# EAGLE design ButtonsLEDs (EAGLE 7.4.0)
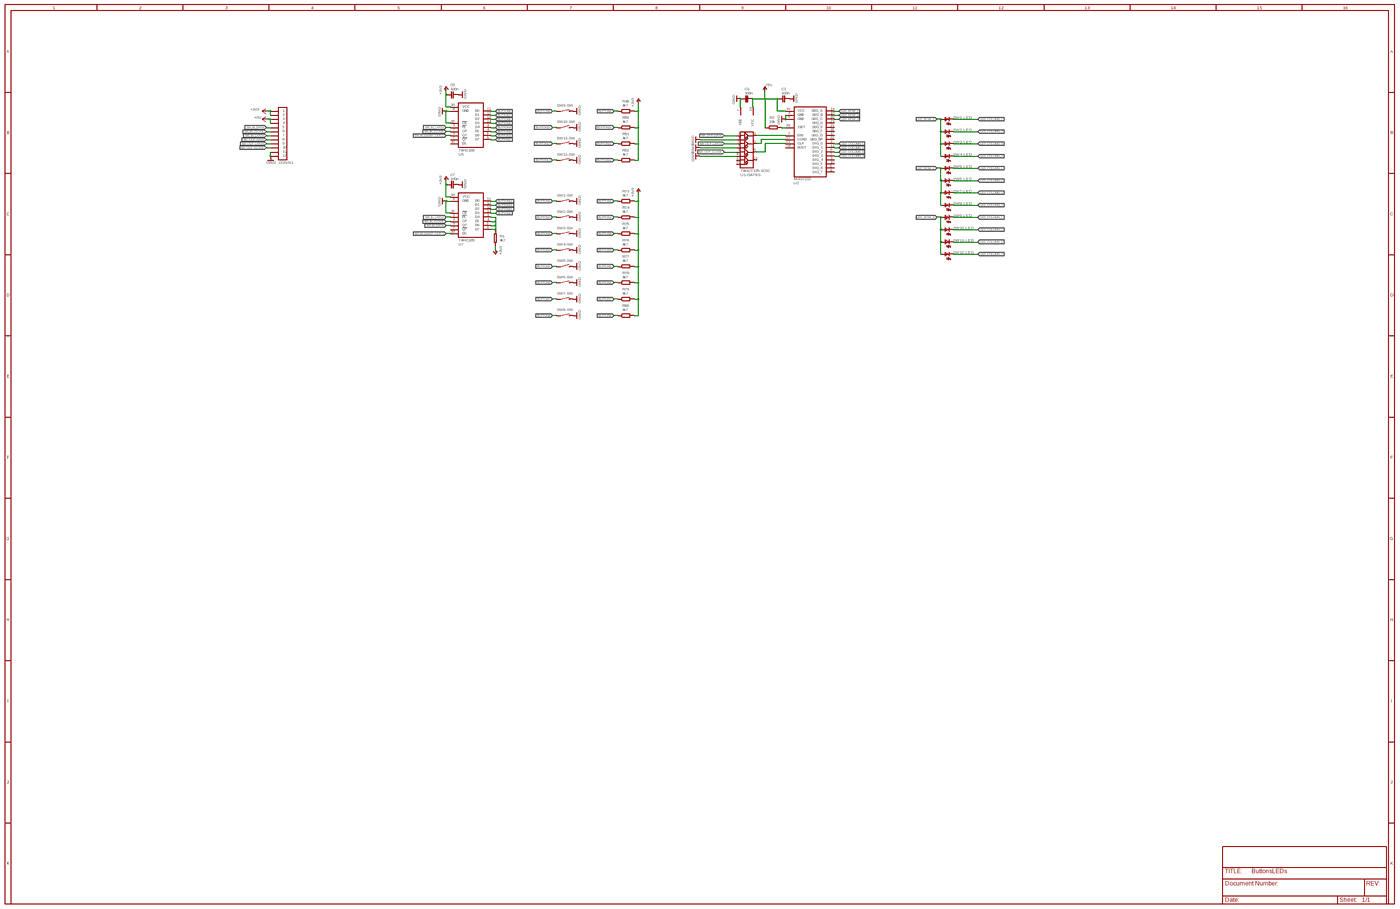
[diagram p0: schematic, sheet 1, overview]
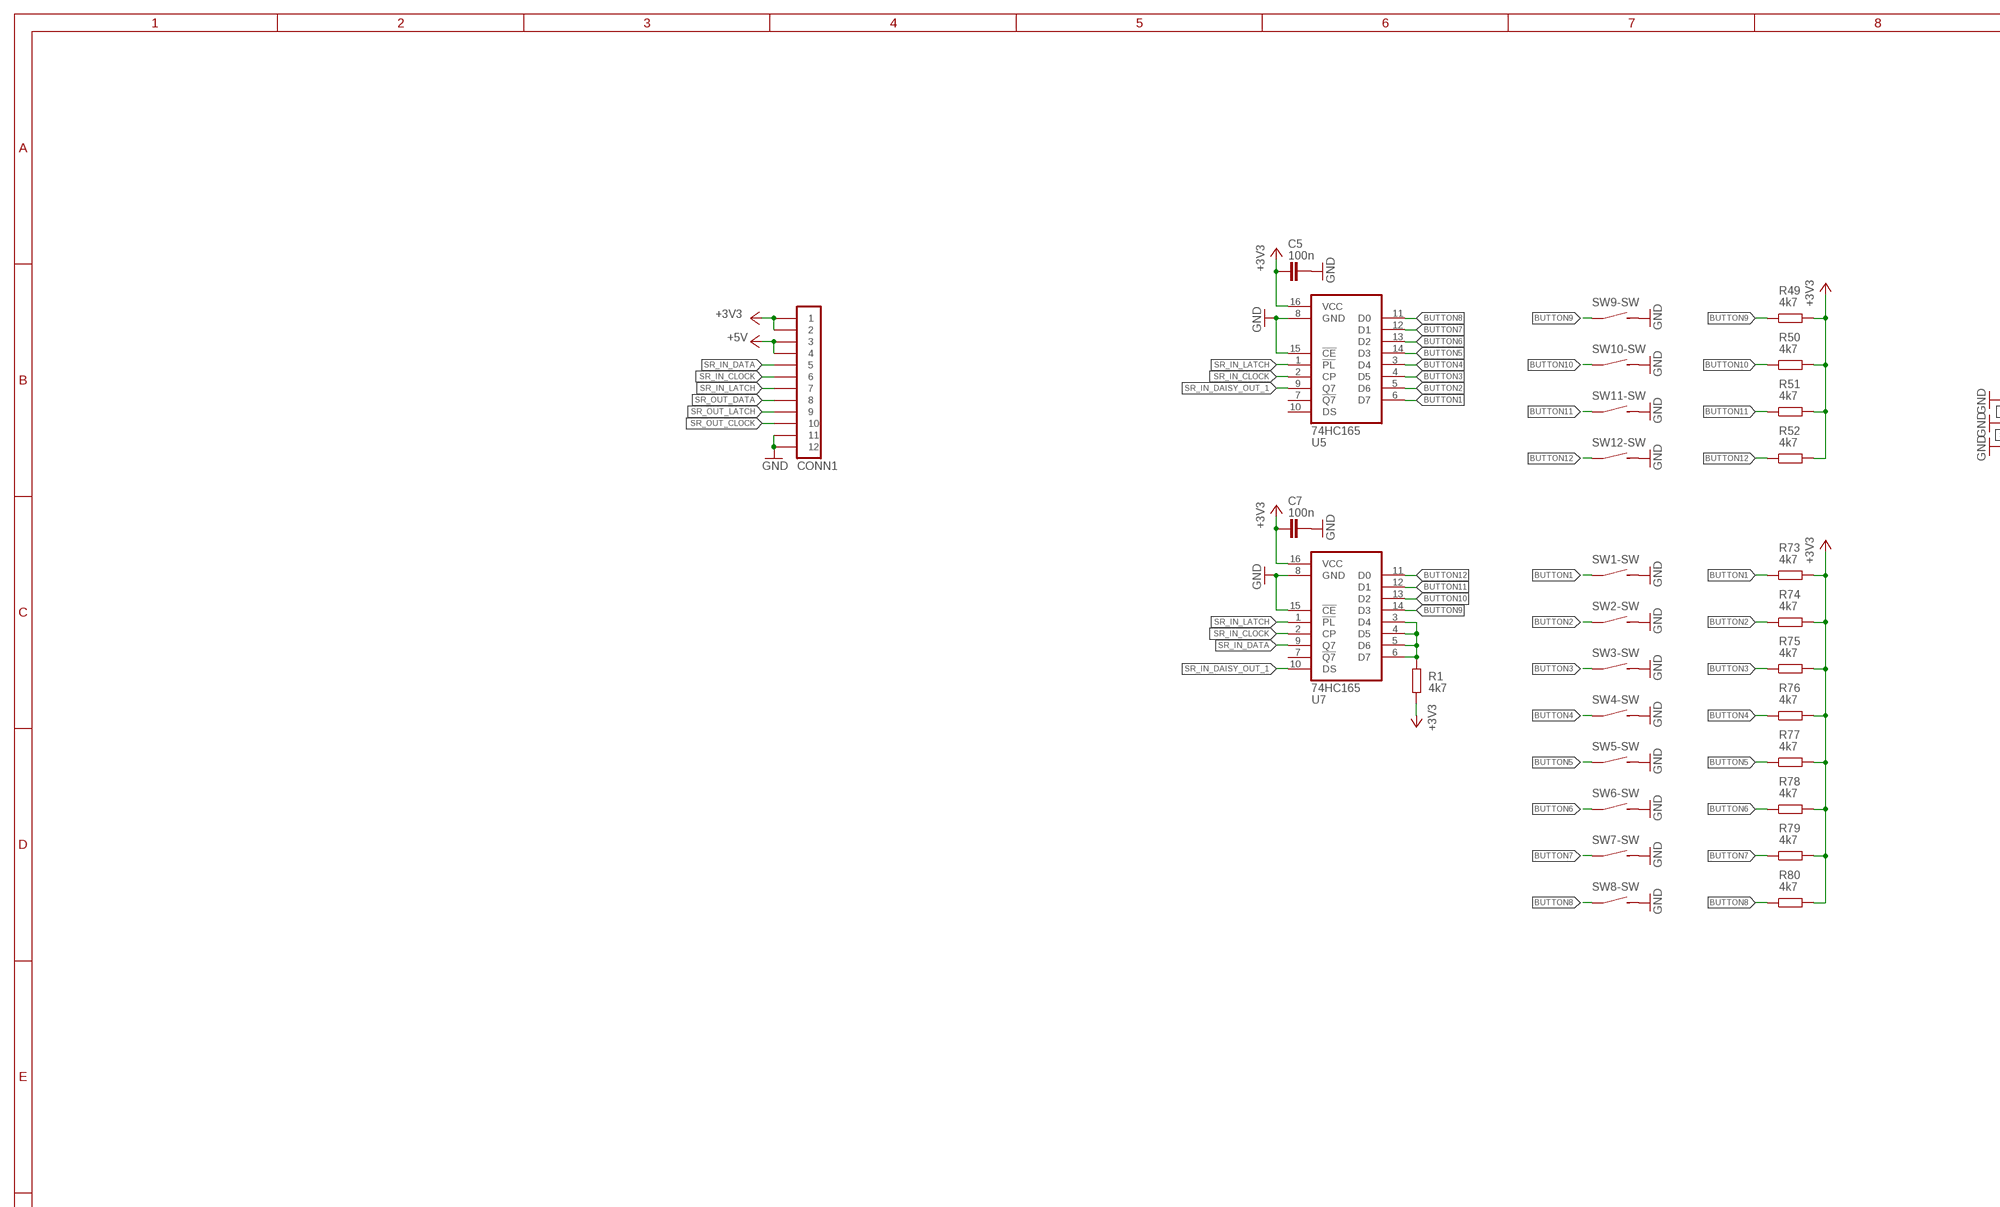
[diagram p1: schematic, sheet 1, part 1 of 4]
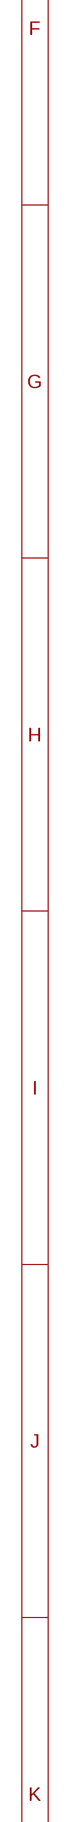
[diagram p2: schematic, sheet 1, part 2 of 4]
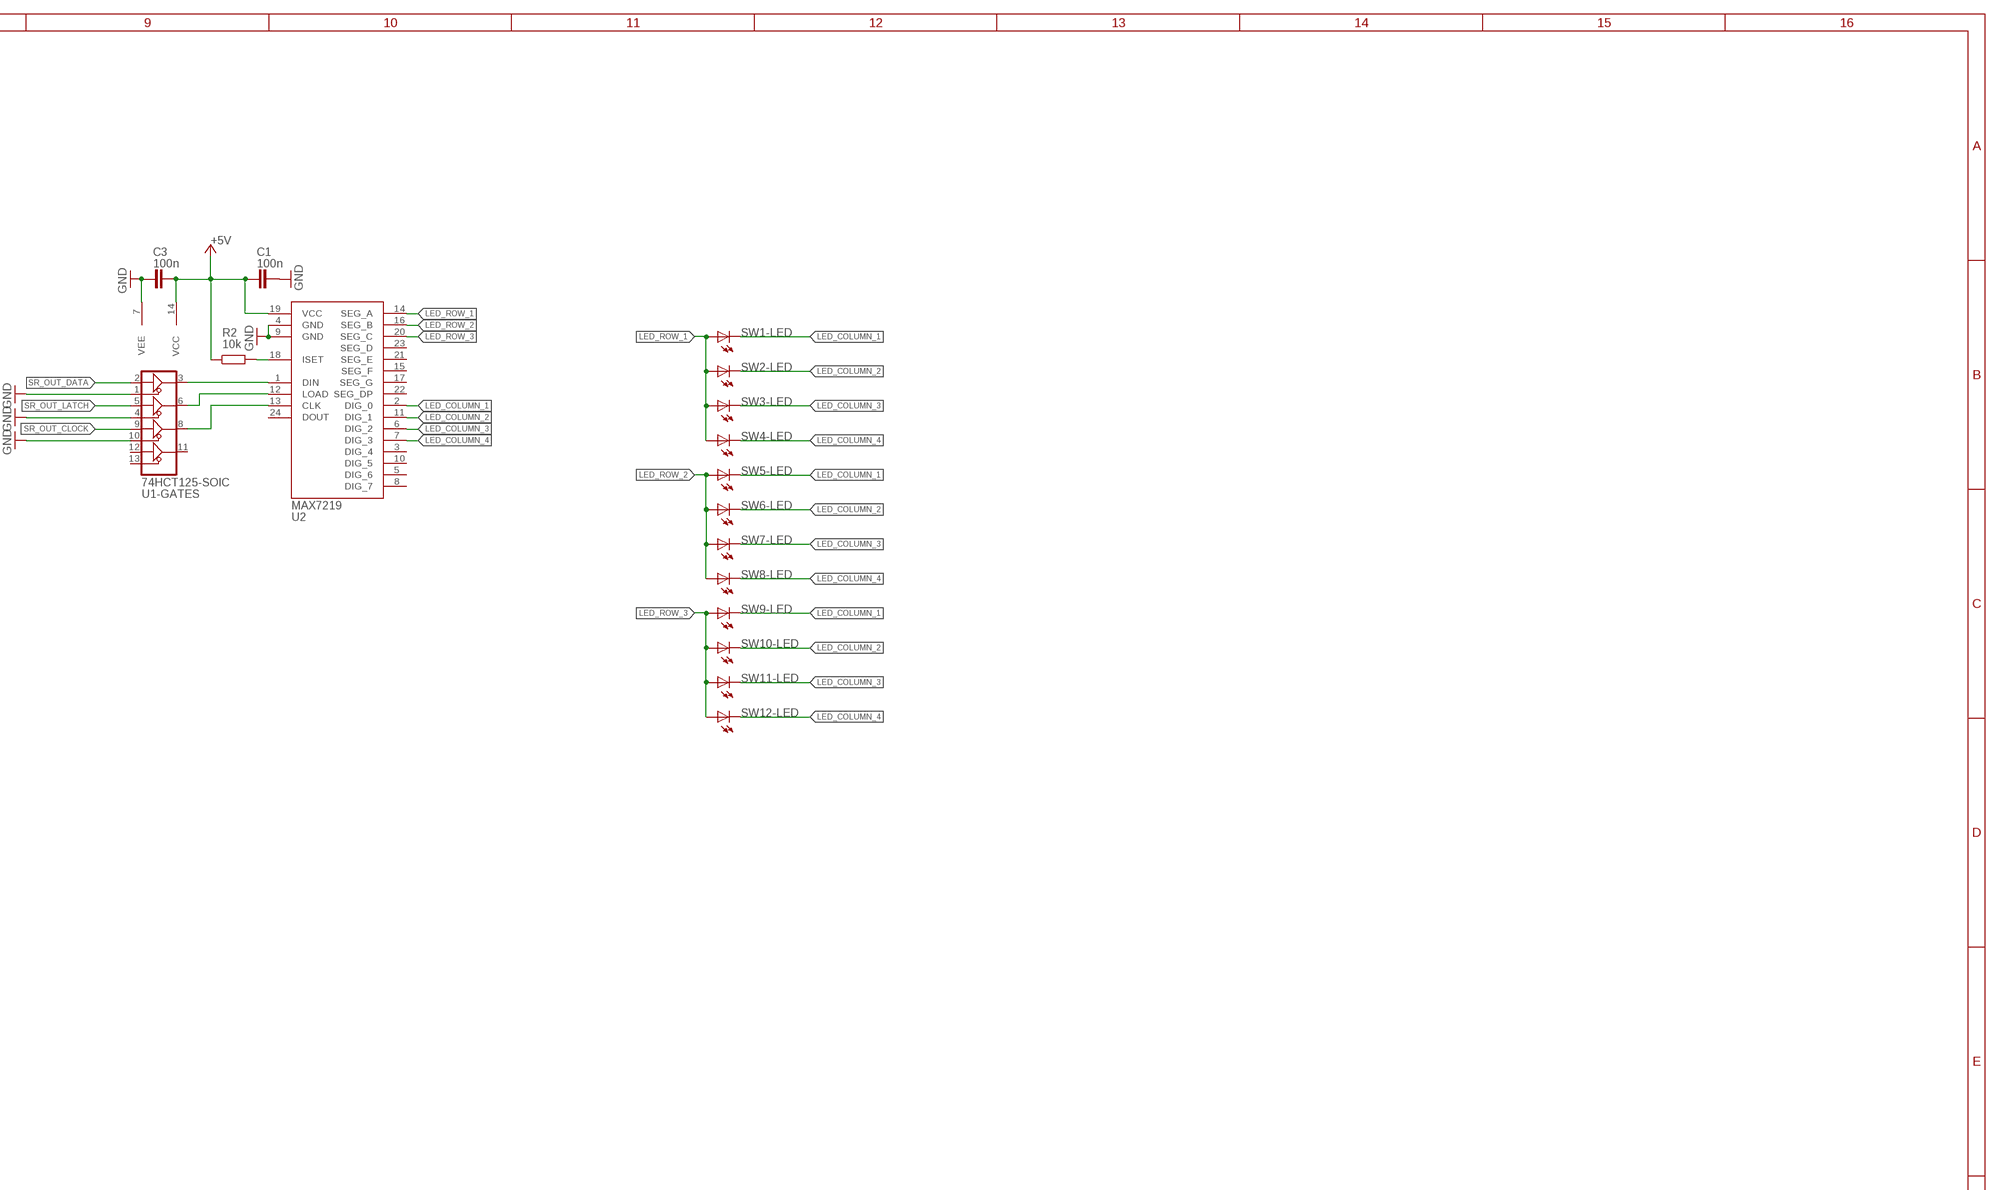
[diagram p3: schematic, sheet 1, part 3 of 4]
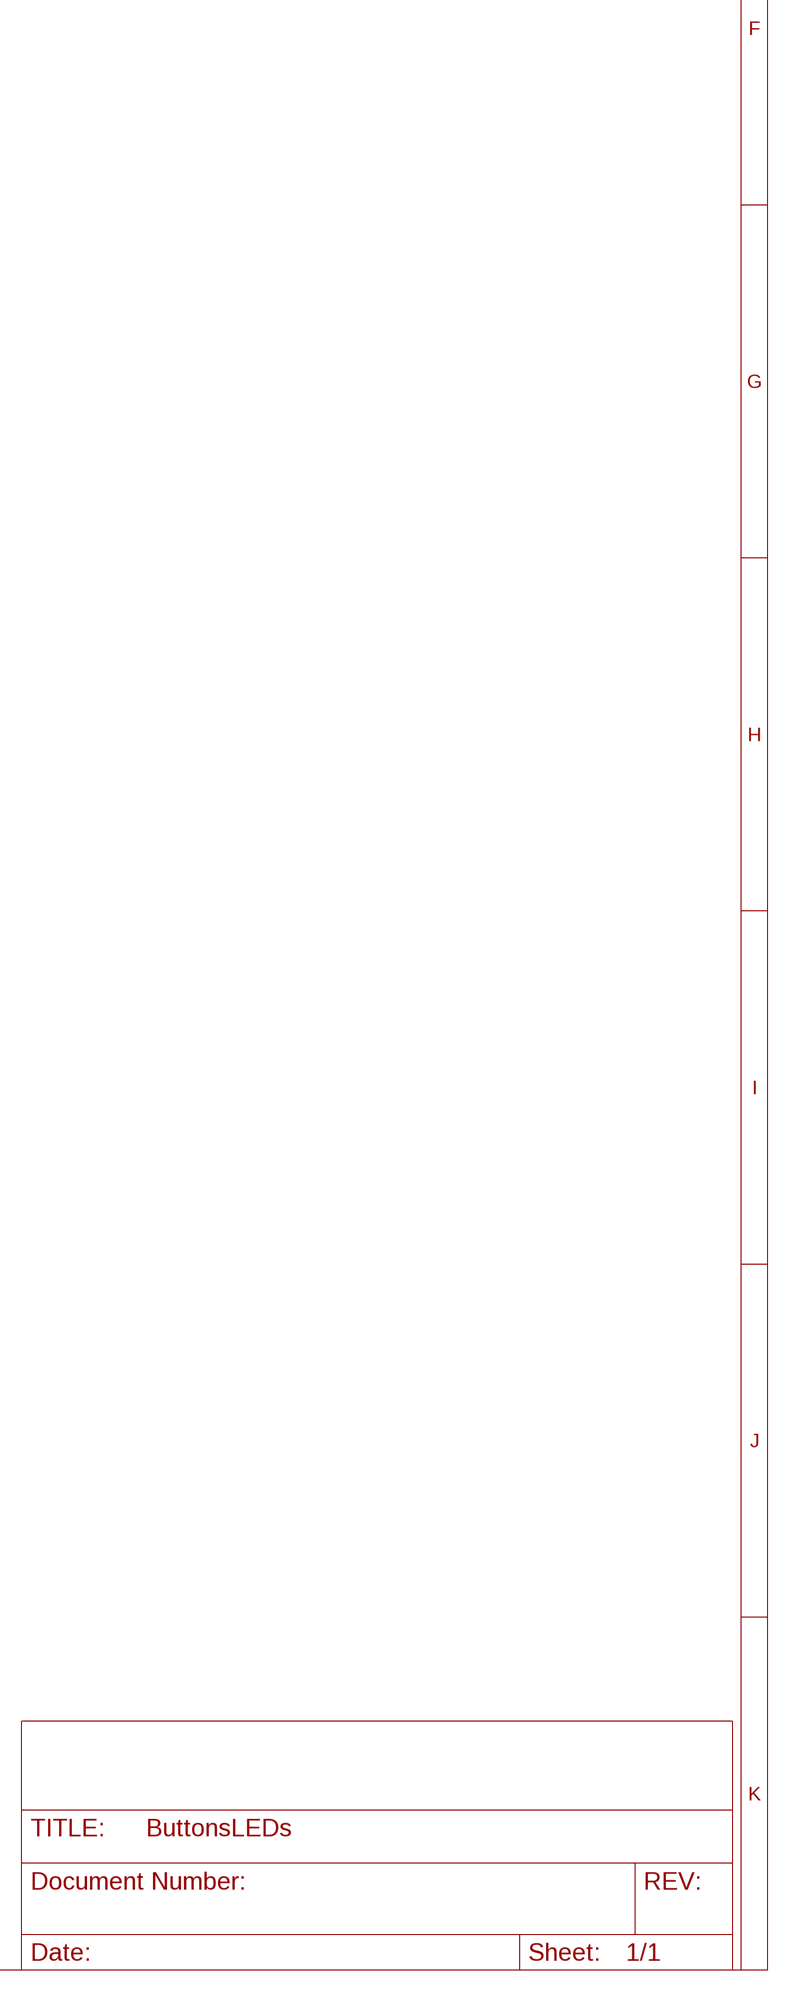
[diagram p4: schematic, sheet 1, part 4 of 4]

## Parts
C1  100n  CAPACITOR-0805  [C0805]
C3  100n  CAPACITOR-0805  [C0805]
C5  100n  CAPACITOR-0805  [C0805]
C7  100n  CAPACITOR-0805  [C0805]
CONN1  PINHD-1X12-SMD  [MOLEX-52271-1279]
R1  4k7  RESISTOR-0805  [R0805]
R2  10k  RESISTOR-0805  [R0805]
R49  4k7  RESISTOR-0805  [R0805]
R50  4k7  RESISTOR-0805  [R0805]
R51  4k7  RESISTOR-0805  [R0805]
R52  4k7  RESISTOR-0805  [R0805]
R73  4k7  RESISTOR-0805  [R0805]
R74  4k7  RESISTOR-0805  [R0805]
R75  4k7  RESISTOR-0805  [R0805]
R76  4k7  RESISTOR-0805  [R0805]
R77  4k7  RESISTOR-0805  [R0805]
R78  4k7  RESISTOR-0805  [R0805]
R79  4k7  RESISTOR-0805  [R0805]
R80  4k7  RESISTOR-0805  [R0805]
SW1  OMRON-B3W-9  [OMRON-B3W-9]
SW2  OMRON-B3W-9  [OMRON-B3W-9]
SW3  OMRON-B3W-9  [OMRON-B3W-9]
SW4  OMRON-B3W-9  [OMRON-B3W-9]
SW5  OMRON-B3W-9  [OMRON-B3W-9]
SW6  OMRON-B3W-9  [OMRON-B3W-9]
SW7  OMRON-B3W-9  [OMRON-B3W-9]
SW8  OMRON-B3W-9  [OMRON-B3W-9]
SW9  OMRON-B3W-9  [OMRON-B3W-9]
SW10  OMRON-B3W-9  [OMRON-B3W-9]
SW11  OMRON-B3W-9  [OMRON-B3W-9]
SW12  OMRON-B3W-9  [OMRON-B3W-9]
U1  74HCT125-SOIC  [SOIC14]
U2  MAX7219  [SO24-W]
U5  74HC165  [SO16]
U7  74HC165  [SO16]

## Nets
+3V3: C5.1 C7.1 CONN1.1 CONN1.2 R1.2 R49.2 R50.2 R51.2 R52.2 R73.2 R74.2 R75.2 R76.2 R77.2 R78.2 R79.2 R80.2 U5.16(VCC) U7.16(VCC)
+5V: C1.1 C3.1 CONN1.3 CONN1.4 R2.1 U1.14(-VCC:VCC) U2.19(VCC)
BUTTON1: R73.1 SW1.1 U5.6(D7)
BUTTON2: R74.1 SW2.1 U5.5(D6)
BUTTON3: R75.1 SW3.1 U5.4(D5)
BUTTON4: R76.1 SW4.1 U5.3(D4)
BUTTON5: R77.1 SW5.1 U5.14(D3)
BUTTON6: R78.1 SW6.1 U5.13(D2)
BUTTON7: R79.1 SW7.1 U5.12(D1)
BUTTON8: R80.1 SW8.1 U5.11(D0)
BUTTON9: R49.1 SW9.1 U7.14(D3)
BUTTON10: R50.1 SW10.1 U7.13(D2)
BUTTON11: R51.1 SW11.1 U7.12(D1)
BUTTON12: R52.1 SW12.1 U7.11(D0)
GND: C1.2 C3.2 C5.2 C7.2 CONN1.11 CONN1.12 SW1.3 SW2.3 SW3.3 SW4.3 SW5.3 SW6.3 SW7.3 SW8.3 SW9.3 SW10.3 SW11.3 SW12.3 U1.1(-GATES:1!(OE)) U1.4(-GATES:2!(OE)) U1.7(-GND:VEE) U1.10(-GATES:3!(OE)) U2.4(GND) U2.9(GND) U5.8(GND) U5.15(!CE) U7.8(GND) U7.15(!CE)
LED_COLUMN_1: SW1.6-C(-LED:C) SW5.6-C(-LED:C) SW9.6-C(-LED:C) U2.2(DIG_0)
LED_COLUMN_2: SW2.6-C(-LED:C) SW6.6-C(-LED:C) SW10.6-C(-LED:C) U2.11(DIG_1)
LED_COLUMN_3: SW3.6-C(-LED:C) SW7.6-C(-LED:C) SW11.6-C(-LED:C) U2.6(DIG_2)
LED_COLUMN_4: SW4.6-C(-LED:C) SW8.6-C(-LED:C) SW12.6-C(-LED:C) U2.7(DIG_3)
LED_ROW_1: SW1.6-A(-LED:A) SW2.6-A(-LED:A) SW3.6-A(-LED:A) SW4.6-A(-LED:A) U2.14(SEG_A)
LED_ROW_2: SW5.6-A(-LED:A) SW6.6-A(-LED:A) SW7.6-A(-LED:A) SW8.6-A(-LED:A) U2.16(SEG_B)
LED_ROW_3: SW9.6-A(-LED:A) SW10.6-A(-LED:A) SW11.6-A(-LED:A) SW12.6-A(-LED:A) U2.20(SEG_C)
N$1: R1.1 U7.3(D4) U7.4(D5) U7.5(D6) U7.6(D7)
N$2: U1.3(-GATES:1Y) U2.1(DIN)
N$3: U1.6(-GATES:2Y) U2.12(LOAD)
N$4: U1.8(-GATES:3Y) U2.13(CLK)
N$5: R2.2 U2.18(ISET)
SR_IN_CLOCK: CONN1.6 U5.2(CP) U7.2(CP)
SR_IN_DAISY_OUT_1: U5.9(Q7) U7.10(DS)
SR_IN_DATA: CONN1.5 U7.9(Q7)
SR_IN_LATCH: CONN1.7 U5.1(!PL) U7.1(!PL)
SR_OUT_CLOCK: CONN1.10 U1.9(-GATES:3A)
SR_OUT_DATA: CONN1.8 U1.2(-GATES:1A)
SR_OUT_LATCH: CONN1.9 U1.5(-GATES:2A)
Unconnected: U1.11(-GATES:4Y) U1.12(-GATES:4A) U1.13(-GATES:4!(OE)) U2.3(DIG_4) U2.5(DIG_6) U2.8(DIG_7) U2.10(DIG_5) U2.15(SEG_F) U2.17(SEG_G) U2.21(SEG_E) U2.22(SEG_DP) U2.23(SEG_D) U2.24(DOUT) U5.7(!Q7) U5.10(DS) U7.7(!Q7)

## Library data of the parts
C1 C3 C5 C7 = igor_lbr:CAPACITOR: Capacitor
CONN1 = igor_lbr:PINHD-1X12: Pin header; MANUFACTURER: Molex; MPN: 52271-1279
R1 R2 R49-R52 R73-R80 = igor_lbr:RESISTOR: Resistor
SW1-SW12 = igor_lbr:OMRON-B3W-9: Illuminated Tactile Switch; MANUFACTURER: Omron; MPN: B3W-9002
U1 = igor_lbr:74*125: Quad buffer/line driver; MANUFACTURER: Nexperia; MPN: 74HCT125D
U2 = igor_lbr:MAX7219: Serially Interfaced, 8-Digit LED Display Drivers
U5 U7 = igor_lbr:74*165: 8-bit parallel-in/serial out shift register; MANUFACTURER: Nexperia; MPN: 74HC165D

## Board
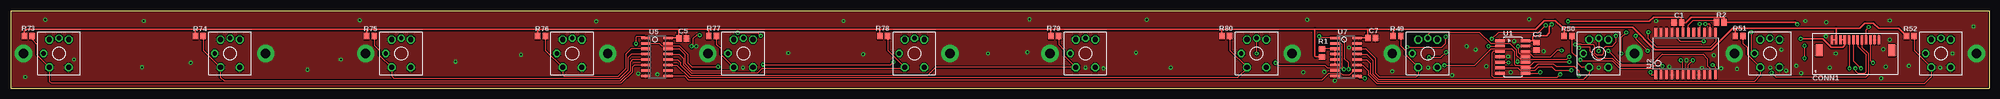
[diagram p5: board, top side]
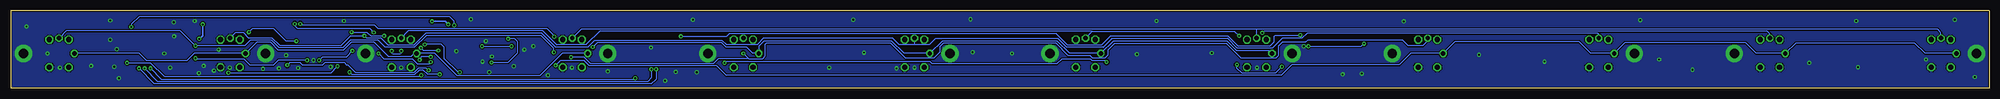
[diagram p6: board, bottom side, seen from below]

Size 462.6 x 18.1 mm. Coordinates in mm from the lower left corner, seen from the top.
Outline: 0,18.1 0,0 462.6,0 462.6,18.1 0,18.1
Copper layers (1*16): Top 0.035mm / dielectric 1.5mm / Bottom 0.035mm
Design rules "smiery": minimum track width 10mil, minimum drill 12mil, track to track 7mil, track to pad 5mil, pad to pad 5mil, via to via 6mil, smd to smd 0mil, copper to edge 12mil, drill to drill 10mil, minimum pad ring 13mil, minimum via ring 10mil, stop-mask expansion 2mil, vias tented up to drill 25mil, thermal gap 10mil

### Footprints (pad centres in the part's own frame; a part is rotated, then mirrored left to right if it is on the bottom)
C0805 = smd 1.27 x 1.524: 1 -0.9,0; 2 0.9,0
MOLEX-52271-1279 = smd 0.6 x 2.2: 1 -5.5,3.5; 2 -4.5,3.5; 3 -3.5,3.5; 4 -2.5,3.5; 5 -1.5,3.5; 6 -0.5,3.5; 7 0.5,3.5; 8 1.5,3.5; 9 2.5,3.5; 10 3.5,3.5; 11 4.5,3.5; 12 5.5,3.5 | smd 1.65 x 2.8: S1 -8.5,1; S2 8.5,1
R0805 = smd 1.27 x 1.524: 1 -0.9,0; 2 0.9,0
OMRON-B3W-9 = drill 1.2 octagon: 1 -3.25,2.25; 2 3.25,2.25; 3 -3.25,-2.25; 4 3.25,-2.25 | drill 1 octagon: 6-A 0,3.6; 6-C 3.6,0
SOIC14 = smd 2.2 x 0.66: 1 -3,3.81; 2 -3,2.54; 3 -3,1.27; 4 -3,0; 5 -3,-1.27; 6 -3,-2.54; 7 -3,-3.81; 8 3,-3.81; 9 3,-2.54; 10 3,-1.27; 11 3,0; 12 3,1.27; 13 3,2.54; 14 3,3.81
SO24-W = smd 2.032 x 0.6: 1 -4.975,6.985; 2 -4.975,5.715; 3 -4.975,4.445; 4 -4.975,3.175; 5 -4.975,1.905; 6 -4.975,0.635; 7 -4.975,-0.635; 8 -4.975,-1.905; 9 -4.975,-3.175; 10 -4.975,-4.445; 11 -4.975,-5.715; 12 -4.975,-6.985; 13 4.975,-6.985; 14 4.975,-5.715; 15 4.975,-4.445; 16 4.975,-3.175; 17 4.975,-1.905; 18 4.975,-0.635; 19 4.975,0.635; 20 4.975,1.905; 21 4.975,3.175; 22 4.975,4.445; 23 4.975,5.715; 24 4.975,6.985
SO16 = smd 2.2 x 0.6: 1 -2.6,4.445; 2 -2.6,3.175; 3 -2.6,1.905; 4 -2.6,0.635; 5 -2.6,-0.635; 6 -2.6,-1.905; 7 -2.6,-3.175; 8 -2.6,-4.445; 9 2.6,-4.445; 10 2.6,-3.175; 11 2.6,-1.905; 12 2.6,-0.635; 13 2.6,0.635; 14 2.6,1.905; 15 2.6,3.175; 16 2.6,4.445

### Placement (x,y rotation side)
C1  389.8,15.3 180 top
C3  356.7,9.8 270 top
C5  157.1,11.6 0 top
C7  318.2,11.7 0 top
CONN1  431.3,7.8 0 top
R1  306.6,8.2 270 top
R2  399.7,15.4 180 top
R49  324.1,12.2 180 top
R50  364.1,12.2 180 top
R51  404.1,12.2 180 top
R52  444.1,12.2 180 top
R73  4.1,12.2 180 top
R74  44.1,12.2 180 top
R75  84.1,12.2 180 top
R76  124.1,12.2 180 top
R77  164.1,12.2 180 top
R78  204.1,12.2 180 top
R79  244.1,12.2 180 top
R80  284.1,12.2 180 top
SW1  11.3,8.1 90 top
SW2  51.3,8.1 90 top
SW3  91.3,8.1 90 top
SW4  131.3,8.1 90 top
SW5  171.3,8.1 90 top
SW6  211.3,8.1 90 top
SW7  251.3,8.1 90 top
SW8  291.3,8.1 90 top
SW9  331.3,8.1 90 top
SW10  371.3,8.1 90 top
SW11  411.3,8.1 90 top
SW12  451.3,8.1 90 top
U1  351.2,7.3 0 top
U2  391.6,8.1 90 top
U5  151.1,7.3 0 top
U7  312.2,7.3 0 top

### Tracks (layer width: path | path; a pad name or v marks a point on that pad's centre or on a via)
+3V3
  Top 0.406: R73.2 3.2,13.3 3.7,13.8 43.2,13.8 | 43.2,13.8 83.3,13.8 | 83.3,13.8 123.4,13.8 | 123.4,13.8 156.2,13.8 | 156.2,13.8 163.2,13.8 | 163.2,13.8 203.3,13.8 | 203.3,13.8 243.1,13.8 | 243.1,13.8 283.3,13.8 | 283.3,13.8 304.9,13.8 | 304.9,13.8 317.2,13.8 | 317.2,13.8 323.3,13.8 | 323.3,13.8 356.6,13.8 358.6,15.8 361.1,15.8 362.7,14.2 | 362.7,14.2 363.2,13.7 R50.2 | 403.2,14 402.6,14 397.6,9 384.4,9 379.2,14.2 362.7,14.2 | 403.2,14 426.8,14 | 426.8,14 432.3,14 433.5,15.2 435.5,15.2 436.7,14 441.4,14 R52.2 | R51.2 403.2,14 | R49.2 323.2,13.7 323.3,13.8 | U7.16 317.25,11.74 C7.1 317.3,13.7 317.2,13.8 | R80.2 283.2,13.7 283.3,13.8 | R79.2 243.2,13.7 243.1,13.8 | R78.2 203.2,13.7 203.3,13.8 | R77.2 163.2,13.8 | U5.16 156.06,11.74 C5.1 156.2,13.8 | R76.2 123.2,13.6 123.4,13.8 | R75.2 83.2,13.7 83.3,13.8 | R74.2 43.2,13.8 | R1.2 305.1,7.3 304.9,7.5 304.9,13.8 | CONN1.1 CONN1.2 426.8,14
+5V  (via drill 0.4 pad 0.6)
  Top 0.406: U1.14 355.9,11.11 | 355.9,11.11 356.29,11.11 C3.1 | C1.1 391.6,15.3 392.9,16.6 400.4,16.6 400.6,16.4 R2.1 417.2,15.4 v417.7,14.9 | U2.19 390.96,15.04 C1.1 | v360.3,14.9 359.7,14.3 359.7,12.9 359.1,12.3 356.2,12.3 355.9,12 355.9,11.11 | C1.1 390.6,15.4 390.6,16.4 390.4,16.6 384.1,16.6 383.1,15.6 v364.1,15.6 | CONN1.3 CONN1.4 428.8,10 428.3,9.5 425.7,9.5 423.7,11.5 v418.5,11.5
  Bottom 0.406: v364.1,15.6 361,15.6 v360.3,14.9 | v417.7,14.9 417.7,12.3 v418.5,11.5
BUTTON1
  Top 0.254: U5.6 145.79,5.39 145.3,4.9 145.3,3.7 142.8,1.2 9.5,1.2 9.05,1.65 SW1.1 6.1,7.8 6.1,10.3 5,11.4 R73.1
BUTTON2
  Top 0.254: U5.5 145.37,6.67 144.8,6.1 144.8,4 142.5,1.7 49.9,1.7 49.05,2.55 SW2.1 45,8.9 R74.1
BUTTON3
  Top 0.254: U5.4 145.13,7.93 144.3,7.1 144.3,4.2 142.4,2.3 89.6,2.3 89.05,2.85 SW3.1 86.2,7.7 86.2,8.8 85,10 R75.1
BUTTON4
  Top 0.254: U5.3 145.1,9.21 143.8,7.9 143.8,4.5 142.1,2.8 129.4,2.8 129.05,3.15 SW4.1 125,8.9 R76.1
BUTTON5
  Top 0.254: U5.14 156.29,9.21 157.7,7.8 157.7,5.7 159.4,4 168.9,4 169.05,4.15 SW5.1 166,7.9 166,9.3 165,10.3 R77.1
BUTTON6
  Top 0.254: U5.13 156.26,7.93 157.2,7 157.2,5.5 159.2,3.5 174.6,3.5 175.75,4.65 208.85,4.65 SW6.1 205,8.9 R78.1
BUTTON7
  Top 0.254: U5.12 155.94,6.67 156.7,5.9 156.7,5.3 159,3 214.4,3 216.25,4.85 SW7.1 246.3,7.6 246.3,8.9 245,10.2 R79.1
BUTTON8
  Top 0.254: U5.11 155.71,5.39 158.6,2.5 286.9,2.5 289.05,4.65 SW8.1 285,8.9 R80.1
BUTTON9
  Top 0.254: U7.14 316.8,9.21 319.1,6.9 319.1,3.5 320.1,2.5 328.5,2.5 329.05,3.05 SW9.1 326,7.9 326,8.9 325,9.9 R49.1
BUTTON10
  Top 0.254: U7.13 317.06,7.93 318.5,6.5 318.5,3.4 319.9,2 367.7,2 369.05,3.35 SW10.1 367.35,4.85 366.1,6.1 366.1,7.3 365,8.4 R50.1
BUTTON11
  Top 0.254: U7.12 317.04,6.67 317.9,5.8 317.9,3.3 319.7,1.5 407.6,1.5 409.05,2.95 SW11.1 406,7.9 406,9.5 405,10.5 R51.1
BUTTON12
  Top 0.254: U7.11 316.11,5.39 317.4,4.1 317.4,3.1 319.5,1 447.4,1 449.05,2.65 SW12.1 445,8.9 R52.1
GND  (via drill 0.4 pad 0.6, 2.2 pad 4)
  other vias: 59.6,8.1 83,8.1 139.6,8.1 163,8.1 219.6,8.1 243,8.1 299.6,8.1 323,8.1 379.6,8.1 403,8.1 459.6,8.1 3,8.1 350.1,7.4 345,5.1 350.7,3.7 151.2,3.2 146.7,3.4 171.2,4.8 160.3,9.8 251.3,4.8 255.5,4.6 309.6,1.7 312.9,9.5 307.1,3.8 395.4,4.7 387.8,5 399.9,4.6 398.2,7.7 358.4,8.6 352.3,6.2 351.5,11 340.4,9.8 419.6,15.7 418.6,3.5 411.4,4.8 331.4,4.8 323,3.9 337,3 371.3,4.8 391.8,6.5 425.3,4.8 426.7,8.1 438.4,5 439.3,11.3 424.4,12.1 355,16.1 303.1,16 342.5,9 403.6,4.5 415.1,4.1 424.5,15.4 437.8,9.1 443.8,5.2 454,8.1 437.3,2.3 271.2,4.8 237.7,8.4 238.2,16.1 265.6,16 417.5,5.2 414,9 384.7,15.7 263.1,8.3 181.8,8.2 199.3,7.9 194.7,15.7 136.9,15.6 119.3,7.8 77.2,6.7 81.6,15.9 104,6.2 228.5,8.1 302.2,3.7 451.1,4.8 458.9,14.4 439.3,15.8 14.8,6.7 3.4,2.6 30.7,4.9 42.1,5.9 69.4,4.3 31.1,15.7 8.1,16
  pour Top (isolate 0.254): 0,18.1 462.6,18.1 462.6,0 0,0
  pour Bottom (isolate 0.254): 0,18.1 462.6,18.1 462.6,0 0,0
LED_COLUMN_1  (via drill 0.4 pad 0.6)
  Top 0.254: SW9.6-C 331.3,12.5 331.9,13.1 343.4,13.1 346,10.5 350.5,10.5 352,9 352,7.7 353,6.7 363.8,6.7 v364.4,7.3 | v367,6.6 367.2,6.4 374.4,6.4 376.2,4.6 385.5,4.6 385.88,4.21 U2.2
  Bottom 0.254: SW1.6-C 11.3,13 12.1,13.8 171.5,13.8 | 171.5,13.8 329.2,13.8 SW9.6-C | SW5.6-C 171.3,13.6 171.5,13.8 | v364.4,7.3 366.6,7.3 366.9,7 366.9,6.7 v367,6.6
LED_COLUMN_2  (via drill 0.4 pad 0.6)
  Top 0.254: v170,12.9 174.7,12.9 v175.4,12.2 | SW10.6-C v371.3,8.7 | v373.5,8.7 376.6,5.6 383.8,5.6 386.1,7.9 395.7,7.9 396.8,6.8 396.8,5.1 397.31,4.58 U2.11
  Bottom 0.254: SW2.6-C 51.3,12.7 51.9,13.3 169.6,13.3 v170,12.9 | SW6.6-C 209.7,13.3 | 209.7,13.3 324.9,13.3 328.1,10.1 334.9,10.1 338.2,13.4 369.6,13.4 SW10.6-C | 209.7,13.3 176.5,13.3 v175.4,12.2 | v371.3,8.7 371.3,8.2 371.6,7.9 373.2,7.9 373.5,8.2 v373.5,8.7
LED_COLUMN_3  (via drill 0.4 pad 0.6)
  Top 0.254: v379.9,12.2 379.9,11.5 v382.7,8.7 | U2.6 390.96,6.04 v390.5,6.5
  Bottom 0.254: SW3.6-C 91.3,12.6 91.5,12.8 159.5,12.8 160.7,11.6 165.3,11.6 167.6,9.3 175.8,9.3 178.1,11.6 205.1,11.6 207.2,9.5 215.7,9.5 217.7,11.5 246.4,11.5 247.8,10.1 251.4,10.1 | SW11.6-C 410.1,12.9 408.1,12.9 406.9,11.7 401.4,11.7 399.6,9.9 385.4,9.9 383.1,12.2 v379.9,12.2 379.4,11.7 376,11.7 374.3,10 368.4,10 365.6,12.8 338.4,12.8 335.2,9.6 327.7,9.6 326.2,11.1 296.2,11.1 295.2,10.1 288.1,10.1 286.6,11.6 256.4,11.6 254.9,10.1 251.4,10.1 | SW7.6-C 251.3,10.2 251.4,10.1 | v382.7,8.7 384.2,7.2 389.8,7.2 v390.5,6.5
LED_COLUMN_4  (via drill 0.4 pad 0.6)
  Top 0.254: v291.3,8.1 SW8.6-C | v331.6,7.2 334.4,7.2 v335.6,8.4 | U2.7 392.24,5.43 v393.3,6.5 | v419.4,7 v419.4,9.9
  Bottom 0.254: SW4.6-C 131.3,11.1 132.5,9.9 135.8,9.9 137.1,11.2 159.4,11.2 159.9,10.7 165.3,10.7 166.2,9.8 166.2,7.6 166.8,7 174.9,7 178.3,10.4 204.6,10.4 206.1,8.9 206.1,7.7 206.8,7 209.6,7 210.2,7.6 215.3,7.6 218.2,10.5 244.6,10.5 245.4,9.7 245.4,8.4 246.8,7 253.3,7 256.8,10.5 285.9,10.5 286.3,10.1 286.3,7.4 286.8,6.9 290.1,6.9 | 290.1,6.9 v291.3,8.1 | 290.1,6.9 297.2,6.9 298.4,5.7 327,5.7 328.5,7.2 v331.6,7.2 | SW12.6-C 449.6,13.4 422.9,13.4 v419.4,9.9 407.9,9.9 406.6,11.2 401.6,11.2 399.8,9.4 385,9.4 383.2,11.2 376.7,11.2 375,9.5 368.2,9.5 365.4,12.3 338.6,12.3 335.6,9.3 v335.6,8.4 | v393.3,6.5 400.1,6.5 401.2,5.4 406.6,5.4 408,6.8 419.2,6.8 v419.4,7
LED_ROW_1  (via drill 0.4 pad 0.6)
  Top 0.254: U2.14 397.31,14.79 397.1,15 v396.2,15 | v335.2,5.3 342.3,5.3 346.2,9.2 350.9,9.2 351.5,8.6 351.5,5.7 351.8,5.4 355.4,5.4 356.2,6.2 364.3,6.2 v364.4,6.1 | v376.6,8.1 376.6,11.9 v377.7,13
  Bottom 0.254: SW1.6-A 15,8.1 17.4,10.5 45.3,10.5 SW2.6-A 54.5,8.1 57,10.6 85.2,10.6 SW3.6-A 93.2,8.1 95.9,10.8 125,10.8 SW4.6-A 135.3,8.1 137.9,5.5 163.1,5.5 165.6,3 295.3,3 297.5,5.2 327.3,5.2 328.5,6.4 334.1,6.4 v335.2,5.3 | v364.4,6.1 364.9,5.6 367.4,5.6 368.6,6.8 375.3,6.8 v376.6,8.1 | v396.2,15 396.2,14.6 395.6,14 378.7,14 v377.7,13
LED_ROW_2  (via drill 0.4 pad 0.6)
  Top 0.254: v326.5,9.6 334.6,9.6 335.5,10.5 v335.5,12 | v394.9,15 394.9,13.2 U2.16
  Bottom 0.254: SW5.6-A 168.3,8.7 175.9,8.7 178.2,11 204.8,11 SW6.6-A 215,8.1 217.9,11 244.8,11 SW7.6-A 253.7,8.1 256.6,11 286.5,11 287.7,9.8 SW8.6-A 289.1,8.1 290.5,9.5 295.3,9.5 296.4,10.6 325.5,10.6 v326.5,9.6 | v394.9,15 394.6,14.7 377.5,14.7 376.7,13.9 337.2,13.9 335.5,12.2 v335.5,12
LED_ROW_3  (via drill 0.4 pad 0.6)
  Top 0.254: U2.20 389.69,11.71 390.4,11 v395.8,11 | v406.9,13.1 406.9,8.9 SW11.6-A
  Bottom 0.254: SW9.6-A 333.7,8.1 338.9,2.9 358.2,2.9 363.4,8.1 SW10.6-A 368.3,8.1 369.1,7.3 374.2,7.3 377.6,10.7 383,10.7 384.8,8.9 400,8.9 401.8,10.7 405.1,10.7 SW11.6-A 419.7,8.1 421.4,6.4 430.8,6.4 432.5,8.1 SW12.6-A | v395.8,11 398.2,11 401.1,13.9 406.1,13.9 v406.9,13.1
N$1
  Top 0.254: U7.6 U7.5 U7.4 U7.3 306.7,9.21 R1.1
N$2  (via drill 0.4 pad 0.6)
  Top 0.254: U1.3 346.67,8.57 346.3,8.2 346.3,2.9 346.7,2.5 361.6,2.5 v362.3,3.2 | U2.1 384.49,3 383.7,3 383.4,3.3 v383.4,3.7
  Bottom 0.254: v362.3,3.2 365.1,3.2 366.1,4.2 367.1,4.2 368.2,3.1 382.8,3.1 v383.4,3.7
N$3  (via drill 0.4 pad 0.6)
  Top 0.254: U2.12 398.58,4.71 v397.9,5.4 | U1.6 352.34,4.76 352.95,4.15 356.45,4.15 357.3,5 360.3,5 361.1,4.2 v364.9,4.2
  Bottom 0.254: v364.9,4.2 365.4,4.7 367.3,4.7 368.4,3.6 381.9,3.6 383.7,5.4 384,5.4 384.5,5.9 389.2,5.9 389.8,5.3 394.3,5.3 394.9,5.9 397.4,5.9 v397.9,5.4
N$4  (via drill 0.4 pad 0.6)
  Top 0.254: v382.9,13.1 382.9,11.5 384.8,9.6 397.3,9.6 398.58,10.88 U2.13 | v375.3,12.2 375.3,10.7 374.3,9.7 372.8,9.7 372.3,9.2 372.3,8 372,7.7 370.9,7.7 370.4,8.2 370.4,9.8 370.1,10.1 367.3,10.1 367.2,10.2 v365.8,10.2 | v357.6,3.7 357.39,3.49 U1.8
  Bottom 0.254: v382.9,13.1 379.3,13.1 378.4,12.2 v375.3,12.2 | v357.6,3.7 358,3.7 361.2,6.9 361.2,9.5 361.9,10.2 v365.8,10.2
N$5
  Top 0.254: U2.18 392.24,14.73 393.4,15.9 398.3,15.9 R2.2
SR_IN_CLOCK  (via drill 0.4 pad 0.6)
  Top 0.254: U5.2 151.57,10.47 152.2,9.85 156.35,9.85 158.3,7.9 158.3,5.9 159.2,5 v165.4,5 | v175.9,5.5 205.8,5.5 v206.4,6.1 | 311.3,4.8 307.8,4.8 307.2,5.4 296.2,5.4 v295.7,5.9 | 311.3,4.8 311.3,10.1 310.93,10.47 U7.2 | 311.3,4.8 v311.7,4.4 | CONN1.6 430.8,6.4 v432.6,4.6
  Bottom 0.254: v206.4,6.1 206.7,6.4 209.7,6.4 210.1,6.8 216.9,6.8 218,5.7 247.1,5.7 247.6,6.2 295.4,6.2 v295.7,5.9 | v165.4,5 166.9,3.5 174.7,3.5 175.9,4.7 v175.9,5.5 | v432.6,4.6 429,1 312.8,1 311.7,2.1 v311.7,4.4
SR_IN_DAISY_OUT_1
  Top 0.254: U5.9 157.54,2.85 158.4,2 306.7,2 308.2,3.5 311,3.5 311.4,3.1 313.1,3.1 314.12,4.12 U7.10
SR_IN_DATA  (via drill 0.4 pad 0.6)
  Top 0.254: v316.6,2.3 315.36,2.3 U7.9 | CONN1.5 429.8,4.7 v429.9,4.6
  Bottom 0.254: v429.9,4.6 427.3,2 317,2 316.7,2.3 v316.6,2.3
SR_IN_LATCH  (via drill 0.4 pad 0.6)
  Top 0.254: v305.9,12.1 306.25,11.74 U7.1 311.25,11.74 311.8,11.2 311.8,6.9 312.8,5.9 v312.8,4.4 | v161.1,12.4 160.4,12.4 159.5,11.5 159.5,10.1 v159.2,9.8 | v146.2,10.4 146.2,11.9 146.4,12.1 148.15,12.1 U5.1 | v431.3,4.6 431.3,4.1 431.9,3.5 433.5,3.5 433.8,3.8 433.8,7.8 431.8,9.8 CONN1.7
  Bottom 0.254: v305.9,12.1 295.2,12.1 294.5,12.8 218.3,12.8 215.6,10.1 207.5,10.1 205.4,12.2 178,12.2 175.7,9.9 168.1,9.9 167.2,10.8 167.2,12.1 166.9,12.4 v161.1,12.4 | v159.2,9.8 146.8,9.8 v146.2,10.4 | v312.8,4.4 312.8,2.4 313.7,1.5 428.2,1.5 v431.3,4.6
SR_OUT_CLOCK  (via drill 0.4 pad 0.6)
  Top 0.254: U1.9 356.16,4.76 357.1,5.7 360.7,5.7 361.3,5.1 365.6,5.1 366.6,4.1 v366.6,3 | CONN1.10 434.8,6.5 v435.4,5.9
  Bottom 0.254: v435.4,5.9 435.3,5.8 429.8,5.8 426.6,2.6 367,2.6 v366.6,3
SR_OUT_DATA  (via drill 0.4 pad 0.6)
  Top 0.254: v411.7,3.6 412.8,2.5 433.7,2.5 434.3,3.1 434.3,8.1 432.8,9.6 CONN1.8 | v386.2,5.1 376.4,5.1 374.6,6.9 371,6.9 369.3,8.6 369.3,9.5 369.2,9.6 366.9,9.6 v366.7,9.4 | v352.4,9.8 352.6,9.6 352.6,8.3 352.95,7.95 355.35,7.95 356.1,7.2 360,7.2 361.6,8.8 v362.6,8.8 | 348.24,9.8 U1.2 348.16,9.8 v345.5,9.8
  Bottom 0.254: v411.7,3.6 387.7,3.6 v386.2,5.1 | v352.4,9.8 v345.5,9.8 | v366.7,9.4 366.1,8.8 v362.6,8.8
SR_OUT_LATCH  (via drill 0.4 pad 0.6)
  Top 0.254: U1.5 350.17,6.03 v350.2,6 | v346.3,11.5 347.9,13.1 357.3,13.1 v358.9,14.7 | CONN1.9 433.8,13.7 v434.4,14.3
  Bottom 0.254: v350.2,6 346.3,6 344,8.3 344,10.8 344.7,11.5 v346.3,11.5 | v358.9,14.7 358.9,15.6 360,16.7 432.6,16.7 434.4,14.9 v434.4,14.3